# Altium schematic sheet Power.SchDoc
size A4
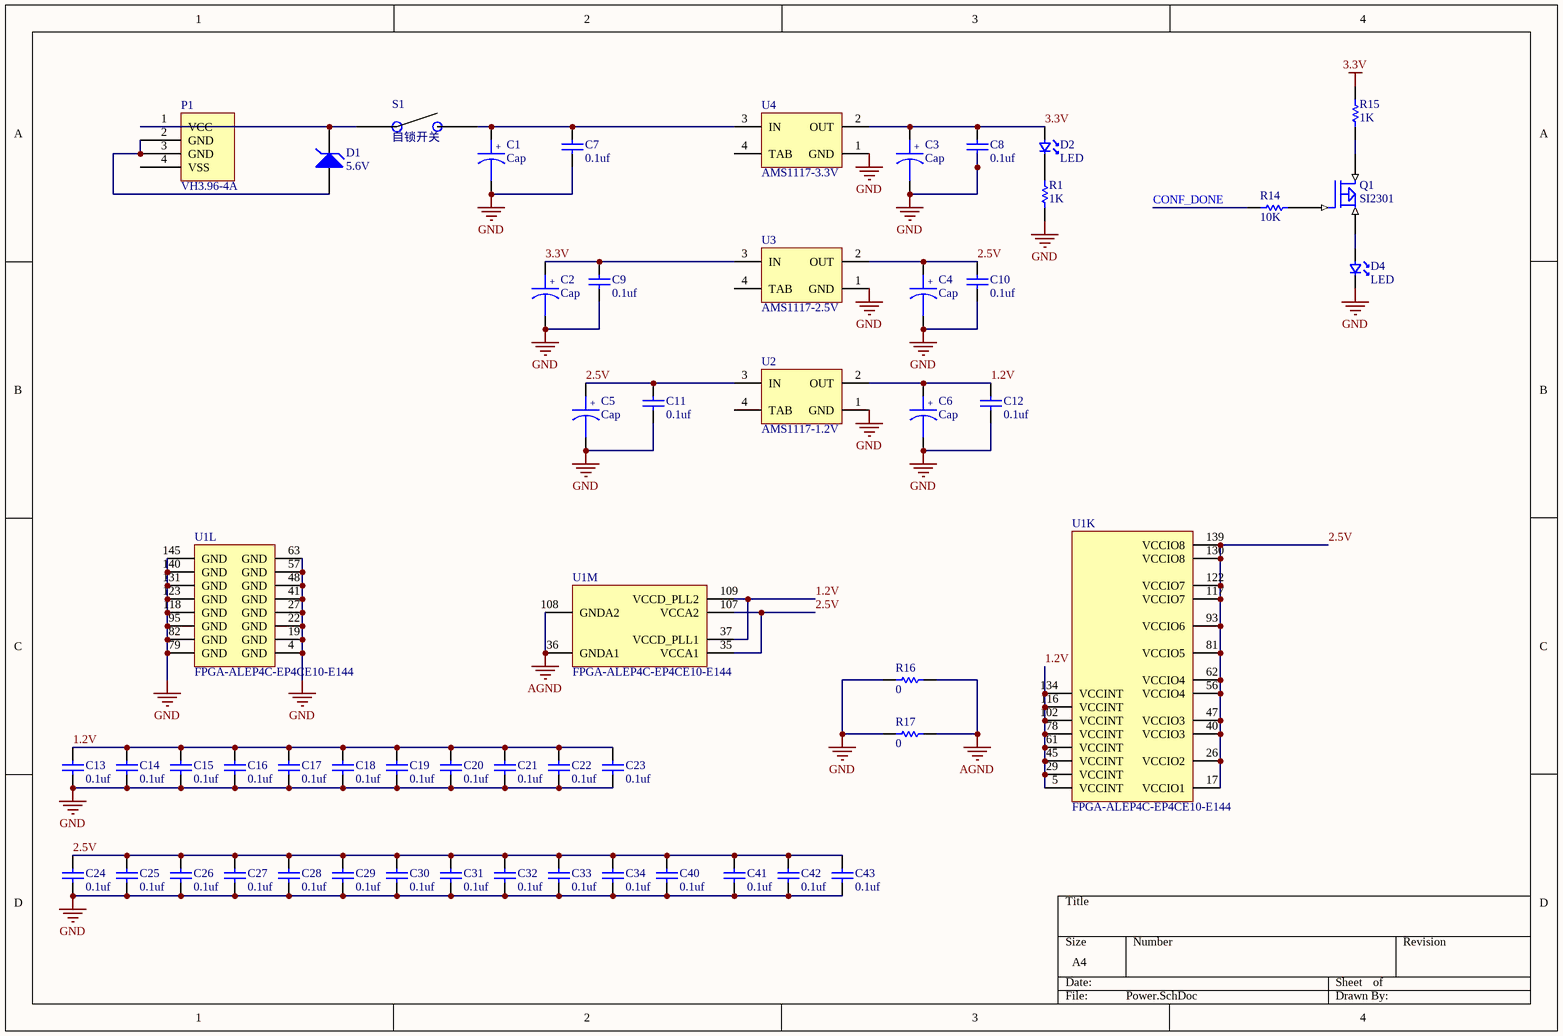
[diagram p0: Power.SchDoc]

## Parts
C1  Cap  [7343-31 TYPE D]
C2  Cap  [7343-31 TYPE D]
C3  Cap  [7343-31 TYPE D]
C4  Cap  [7343-31 TYPE D]
C5  Cap  [7343-31 TYPE D]
C6  Cap  [7343-31 TYPE D]
C7  0.1uf  [0805]
C8  0.1uf  [0805]
C9  0.1uf  [0805]
C10  0.1uf  [0805]
C11  0.1uf  [0805]
C12  0.1uf  [0805]
C13  0.1uf  [0805]
C14  0.1uf  [0805]
C15  0.1uf  [0805]
C16  0.1uf  [0805]
C17  0.1uf  [0805]
C18  0.1uf  [0805]
C19  0.1uf  [0805]
C20  0.1uf  [0805]
C21  0.1uf  [0805]
C22  0.1uf  [0805]
C23  0.1uf  [0805]
C24  0.1uf  [0805]
C25  0.1uf  [0805]
C26  0.1uf  [0805]
C27  0.1uf  [0805]
C28  0.1uf  [0805]
C29  0.1uf  [0805]
C30  0.1uf  [0805]
C31  0.1uf  [0805]
C32  0.1uf  [0805]
C33  0.1uf  [0805]
C34  0.1uf  [0805]
C40  0.1uf  [0805]
C41  0.1uf  [0805]
C42  0.1uf  [0805]
C43  0.1uf  [0805]
D1  5.6V  [SMA/DO-214AC]
D2  LED  [0805_s]
D4  LED  [0805_s]
P1  VH3.96-4A  [VH3.96-4P]
Q1  SI2301  [SOT-23]
R1  1K  [0805]
R14  10K  [0805]
R15  1K  [0805]
R16  0  [0805]
R17  0  [0805]
S1  自锁开关  [AN88]
U1  FPGA-ALEP4C-EP4CE10-E144  [EQFP144_A-165_D2-54_L]  (parts K,L,M of 13)
U2  AMS1117-1.2V  [SOT223]
U3  AMS1117-2.5V  [SOT223]
U4  AMS1117-3.3V  [SOT223]

## Nets
3.3V: C2.1 C3.1 C8.2 C9.2 D2.2 R15.2 U3.3(IN) U4.2(OUT)
AGND: R16.2 R17.2 U1.36(GNDA1) U1.108(GNDA2)
GND: C1.2 C2.2 C3.2 C4.2 C5.2 C6.2 C7.1 C8.1 C9.1 C10.1 C11.1 C12.1 C13.1 C14.1 C15.1 C16.1 C17.1 C18.1 C19.1 C20.1 C21.1 C22.1 C23.1 C24.1 C25.1 C26.1 C27.1 C28.1 C29.1 C30.1 C31.1 C32.1 C33.1 C34.1 C40.1 C41.1 C42.1 C43.1 D4.1 R1.1 R16.1 R17.1 U1.4(GND) U1.19(GND) U1.22(GND) U1.27(GND) U1.41(GND) U1.48(GND) U1.57(GND) U1.63(GND) U1.79(GND) U1.82(GND) U1.95(GND) U1.118(GND) U1.123(GND) U1.131(GND) U1.140(GND) U1.145(GND) U2.1(GND) U3.1(GND) U4.1(GND)
1.2V: C6.1 C12.2 C13.2 C14.2 C15.2 C16.2 C17.2 C18.2 C19.2 C20.2 C21.2 C22.2 C23.2 U1.5(VCCINT) U1.29(VCCINT) U1.37(VCCD_PLL1) U1.45(VCCINT) U1.61(VCCINT) U1.78(VCCINT) U1.102(VCCINT) U1.109(VCCD_PLL2) U1.116(VCCINT) U1.134(VCCINT) U2.2(OUT)
2.5V: C4.1 C5.1 C10.2 C11.2 C24.2 C25.2 C26.2 C27.2 C28.2 C29.2 C30.2 C31.2 C32.2 C33.2 C34.2 C40.2 C41.2 C42.2 C43.2 U1.17(VCCIO1) U1.26(VCCIO2) U1.35(VCCA1) U1.40(VCCIO3) U1.47(VCCIO3) U1.56(VCCIO4) U1.62(VCCIO4) U1.81(VCCIO5) U1.93(VCCIO6) U1.107(VCCA2) U1.117(VCCIO7) U1.122(VCCIO7) U1.130(VCCIO8) U1.139(VCCIO8) U2.3(IN) U3.2(OUT)
CONF_DONE: R14.1
NetC1_1: C1.1 C7.2 S1.6 U4.3(IN)
NetD1_1: D1.1(A) P1.2(GND) P1.3(GND)
NetD1_2: D1.2(K) P1.1(VCC) S1.4
NetD2_1: D2.1 R1.2
NetD4_2: D4.2 Q1.3(D)
NetQ1_1: Q1.1(G) R14.2
NetQ1_2: Q1.2(S) R15.1

Not connected (* = marked no-connect by the designer): P1 4(VSS); U2 4(TAB); U3 4(TAB); U4 4(TAB)

## Notes on the sheet
- (in symbol Tantalium Cap) +

## Library data of the parts
C1-C6 = Tantalium Cap
C7-C34 C40-C43 = Cap
D1 = 肖特基-5.6V
R1 R14-R17 = Res